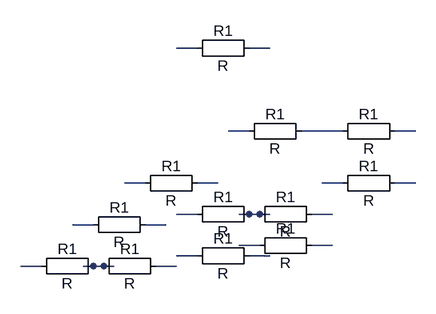
[diagram p0: schematic circuit.asc]
circuit.asc, the LTspice schematic file:
Version 4
SHEET 1 880 680
WIRE 384 336 352 336
WIRE 464 336 496 336
SYMBOL Misc\EuropeanResistor 480 320 R90
WINDOW 0 5 56 VBottom 2
WINDOW 3 27 56 VTop 2
SYMATTR InstName R1
WIRE 208 288 176 288
WIRE 288 288 320 288
SYMBOL Misc\EuropeanResistor 304 272 R90
WINDOW 0 5 56 VBottom 2
WINDOW 3 27 56 VTop 2
SYMATTR InstName R1
WIRE 512 208 480 208
WIRE 592 208 624 208
SYMBOL Misc\EuropeanResistor 608 192 R90
WINDOW 0 5 56 VBottom 2
WINDOW 3 27 56 VTop 2
SYMATTR InstName R1
WIRE 368 208 336 208
WIRE 448 208 480 208
SYMBOL Misc\EuropeanResistor 464 192 R90
WINDOW 0 5 56 VBottom 2
WINDOW 3 27 56 VTop 2
SYMATTR InstName R1
WIRE 288 336 256 336
WIRE 368 336 400 336
SYMBOL Misc\EuropeanResistor 384 320 R90
WINDOW 0 5 56 VBottom 2
WINDOW 3 27 56 VTop 2
SYMATTR InstName R1
WIRE 128 352 96 352
WIRE 208 352 240 352
SYMBOL Misc\EuropeanResistor 224 336 R90
WINDOW 0 5 56 VBottom 2
WINDOW 3 27 56 VTop 2
SYMATTR InstName R1
WIRE 288 80 256 80
WIRE 368 80 400 80
SYMBOL Misc\EuropeanResistor 384 64 R90
WINDOW 0 5 56 VBottom 2
WINDOW 3 27 56 VTop 2
SYMATTR InstName R1
WIRE 288 400 256 400
WIRE 368 400 400 400
SYMBOL Misc\EuropeanResistor 384 384 R90
WINDOW 0 5 56 VBottom 2
WINDOW 3 27 56 VTop 2
SYMATTR InstName R1
WIRE 512 288 480 288
WIRE 592 288 624 288
SYMBOL Misc\EuropeanResistor 608 272 R90
WINDOW 0 5 56 VBottom 2
WINDOW 3 27 56 VTop 2
SYMATTR InstName R1
WIRE 48 416 16 416
WIRE 128 416 160 416
SYMBOL Misc\EuropeanResistor 144 400 R90
WINDOW 0 5 56 VBottom 2
WINDOW 3 27 56 VTop 2
SYMATTR InstName R1
WIRE 384 384 352 384
WIRE 464 384 496 384
SYMBOL Misc\EuropeanResistor 480 368 R90
WINDOW 0 5 56 VBottom 2
WINDOW 3 27 56 VTop 2
SYMATTR InstName R1
WIRE 144 416 112 416
WIRE 224 416 256 416
SYMBOL Misc\EuropeanResistor 240 400 R90
WINDOW 0 5 56 VBottom 2
WINDOW 3 27 56 VTop 2
SYMATTR InstName R1

The netlist it stands for:
* circuit.asc
R1 N002 N001 R
R1 N004 N003 R
R1 N006 N005 R
R1 N005 N007 R
R1 N001 N008 R
R1 N010 N009 R
R1 N012 N011 R
R1 N014 N013 R
R1 N016 N015 R
R1 N018 N017 R
R1 N020 N019 R
R1 N021 N018 R
.backanno
.end